# Altium schematic sheet MCU.SchDoc: FlightControlBoard-MCU
size A4; SheetNumber: 1; SheetTotal: 5
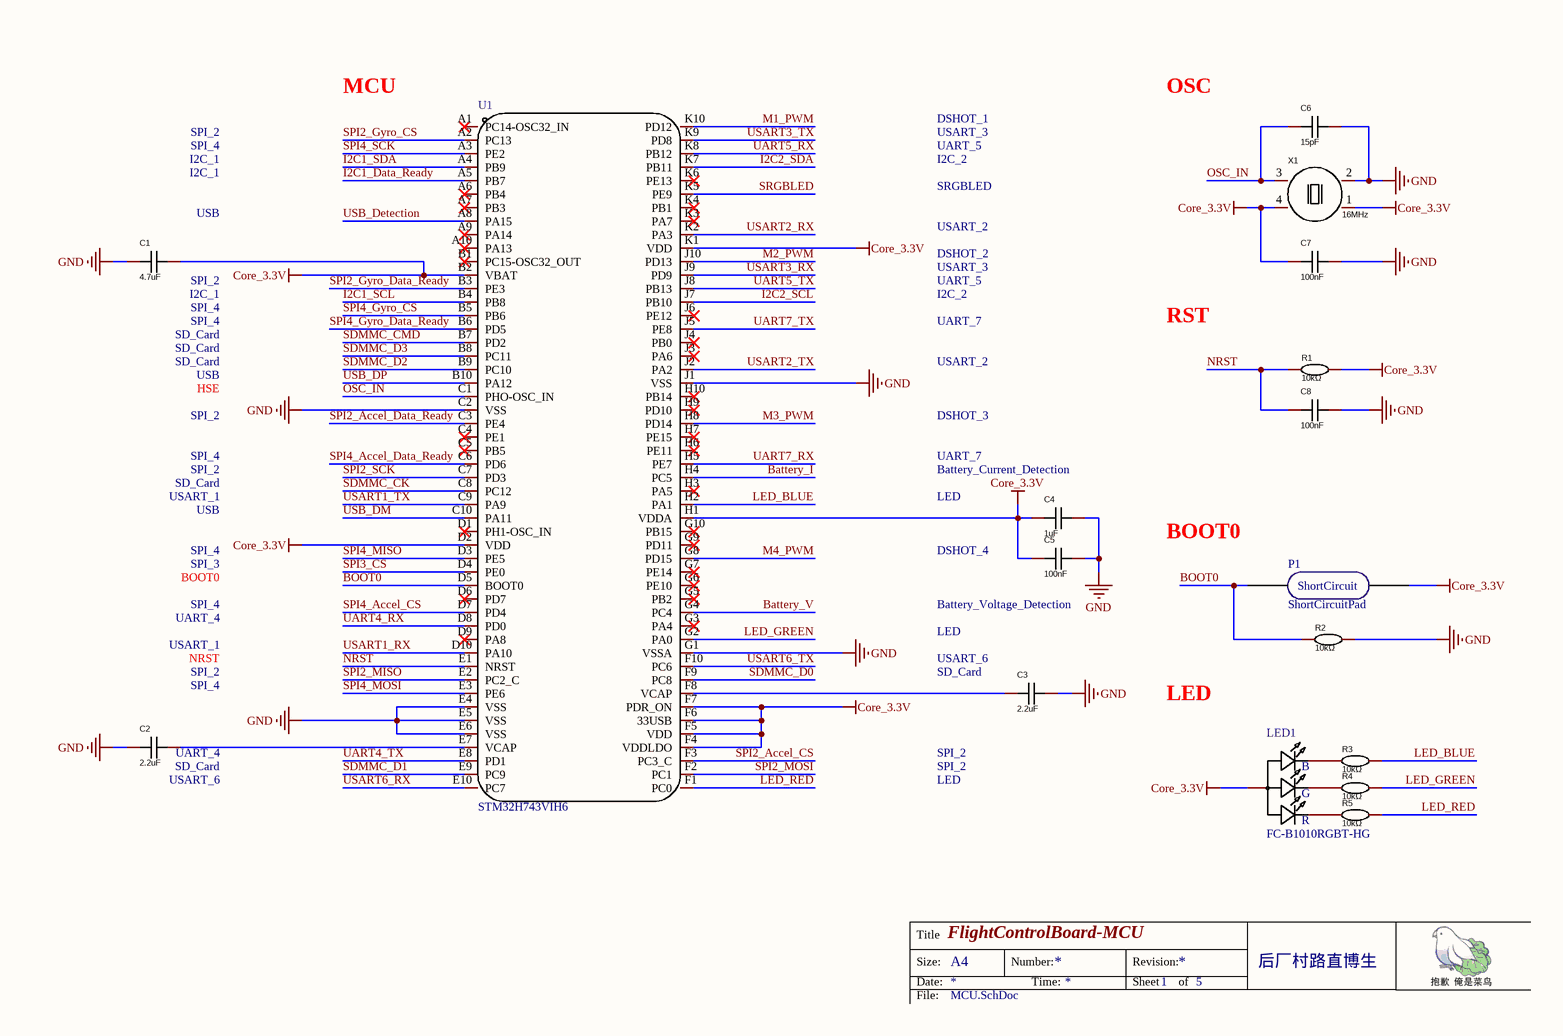
[diagram p0: MCU.SchDoc]

## Parts
C1  4.7uF  [C0402]
C2  2.2uF  [C0402]
C3  2.2uF  [C0402]
C4  1uF  [C0201]
C5  100nF  [C0201]
C6  15pF  [C0201]
C7  100nF  [C0201]
C8  100nF  [C0201]
LED1  FC-B1010RGBT-HG  [LED-ARRAY-SMD_4P-L1.0-W1.0-TR-RD]
P1  ShortCircuitPad  [ShortCircuitPad]
R1  10kΩ  [R0201]
R2  10kΩ  [R0201]
R3  10kΩ  [R0201]
R4  10kΩ  [R0201]
R5  10kΩ  [R0201]
U1  STM32H743VIH6  [BGA-100_L8.0-W8.0-P0.80-R10-C10-BL]
X1  value 16MHz  [OSC-SMD_4P-L2.5-W2.0-BL]  (hidden comment: X1G004171002700)

## Nets
Core_3.3V: C1.1 C4.2 C5.2 C7.2 LED1.1(+) P1.2 R1.2 U1.B2(VBAT) U1.D2(VDD) U1.F4(VDDLDO) U1.F5(VDD) U1.F6(33USB) U1.F7(PDR_ON) U1.H1(VDDA) U1.K1(VDD) X1.1(/ST) X1.4(VDD)
GND: C1.2 C2.2 C3.1 C4.1 C5.1 C6.1 C7.1 C8.1 R2.2 U1.C2(VSS) U1.E4(VSS) U1.E5(VSS) U1.E6(VSS) U1.G1(VSSA) U1.J1(VSS) X1.2(GND)
Battery_I: U1.H4(PC5)
Battery_V: U1.G4(PC4)
BOOT0: P1.1 R2.1 U1.D5(BOOT0)
I2C1_Data_Ready: U1.A5(PB7)
I2C1_SCL: U1.B4(PB8)
I2C1_SDA: U1.A4(PB9)
I2C2_SCL: U1.J7(PB10)
I2C2_SDA: U1.K7(PB11)
LED_BLUE: R3.2 U1.H2(PA1)
LED_GREEN: R4.2 U1.G2(PA0)
LED_RED: R5.2 U1.F1(PC0)
M1_PWM: U1.K10(PD12)
M2_PWM: U1.J10(PD13)
M3_PWM: U1.H8(PD14)
M4_PWM: U1.G8(PD15)
NRST: C8.2 R1.1 U1.E1(NRST)
OSC_IN: C6.2 U1.C1(PHO-OSC_IN) X1.3(OUT)
SDMMC_CK: U1.C8(PC12)
SDMMC_CMD: U1.B7(PD2)
SDMMC_D0: U1.F9(PC8)
SDMMC_D1: U1.E9(PC9)
SDMMC_D2: U1.B9(PC10)
SDMMC_D3: U1.B8(PC11)
SPI2_Accel_CS: U1.F3(PC3_C)
SPI2_Accel_Data_Ready: U1.C3(PE4)
SPI2_Gyro_CS: U1.A2(PC13)
SPI2_Gyro_Data_Ready: U1.B3(PE3)
SPI2_MISO: U1.E2(PC2_C)
SPI2_MOSI: U1.F2(PC1)
SPI2_SCK: U1.C7(PD3)
SPI3_CS: U1.D4(PE0)
SPI4_Accel_CS: U1.D7(PD4)
SPI4_Accel_Data_Ready: U1.C6(PD6)
SPI4_Gyro_CS: U1.B5(PB6)
SPI4_Gyro_Data_Ready: U1.B6(PD5)
SPI4_MISO: U1.D3(PE5)
SPI4_MOSI: U1.E3(PE6)
SPI4_SCK: U1.A3(PE2)
SRGBLED: U1.K5(PE9)
UART4_RX: U1.D8(PD0)
UART4_TX: U1.E8(PD1)
UART5_RX: U1.K8(PB12)
UART5_TX: U1.J8(PB13)
UART7_RX: U1.H5(PE7)
UART7_TX: U1.J5(PE8)
USART1_RX: U1.D10(PA10)
USART1_TX: U1.C9(PA9)
USART2_RX: U1.K2(PA3)
USART2_TX: U1.J2(PA2)
USART3_RX: U1.J9(PD9)
USART3_TX: U1.K9(PD8)
USART6_RX: U1.E10(PC7)
USART6_TX: U1.F10(PC6)
USB_Detection: U1.A8(PA15)
USB_DM: U1.C10(PA11)
USB_DP: U1.B10(PA12)
NetC2_1: C2.1 U1.E7(VCAP)
NetC3_2: C3.2 U1.F8(VCAP)
NetLED1_2: LED1.2(-) R5.1
NetLED1_3: LED1.3(-) R4.1
NetLED1_4: LED1.4(-) R3.1

Not connected (* = marked no-connect by the designer): U1 A1(PC14-OSC32_IN)* A6(PB4)* A7(PB3)* A9(PA14)* A10(PA13)* B1(PC15-OSC32_OUT)* C4(PE1)* C5(PB5)* D1(PH1-OSC_IN)* D6(PD7)* D9(PA8)* G3(PA4)* G5(PB2)* G6(PE10)* G7(PE14)* G9(PD11)* G10(PB15)* H3(PA5)* H6(PE11)* H7(PE15)* H9(PD10)* H10(PB14)* J3(PA6)* J4(PB0)* J6(PE12)* K3(PA7)* K4(PB1)* K6(PE13)*

## Notes on the sheet
- MCU
- OSC
- I2C_1
- SPI_2
- SPI_4
- I2C_2
- UART_5
- USART_3
- DSHOT_1
- USB
- USART_2
- SRGBLED
- (near C1) SPI_2
- (near C1) SPI_4
- (near C1) I2C_1
- DSHOT_2
- SD_Card
- UART_7
- RST
- HSE
- DSHOT_3
- USART_1
- (near C4) Battery_Current_Detection
- LED
- SPI_3
- BOOT0
- DSHOT_4
- UART_4
- (near C5) Battery_Voltage_Detection
- NRST
- (near C3) SD_Card
- (near C3) USART_6
- (near C2) SD_Card
- (near C2) UART_4
- (near C2) USART_6
- Title
- Size:
- Date:
- A4
- Number:
- Time:
- Revision:
- Sheet
- of
- 后厂村路直博生
- File:
- (in symbol FC-B1010RGBT-HG) B; G; R
- (in symbol ShortCircuitPad) ShortCircuit

## Library data of the parts
C1-C8 = CC0603KRX7R9BB104: Add into BOM: yes; Convert to PCB: yes
  C1: Value: 4.7uF
  C2 C3: Value: 2.2uF
  C4: Value: 1uF
  C5 C7 C8: Value: 100nF
  C6: Value: 15pF
LED1 = FC-B1010RGBT-HG: Manufacturer: 国星光电; Add into BOM: yes; Emitted Color: RGB三色; Name: FC-B1010RGBT-HG; Symbol: FC-B1010RGBT-HG; Device: FC-B1010RGBT-HG; LCSC Part Name: RGB三色 1010RGB   金线; Supplier Part: C158099; Manufacturer Part: FC-B1010RGBT-HG; Supplier Footprint: 0404; JLCPCB Part Class: Extended Part; Datasheet: https://atta.szlcsc.com/upload/public/pdf/source/20200910/C158099_0C805F16310A4C6DB0163E8F613FF382.pdf; Supplier: LCSC; Convert to PCB: yes
R1-R5 = 0603WAF1002T5E: Add into BOM: yes; Name: 10kΩ; Convert to PCB: yes; Value: 10kΩ
U1 = STM32H743VIH6: Manufacturer: ST(意法半导体); Add into BOM: yes; Name: STM32H743VIH6; Symbol: STM32H743VIH6; Device: STM32H743VIH6; LCSC Part Name: STM32H743VIH6; Supplier Part: C964146; Manufacturer Part: STM32H743VIH6; Supplier Footprint: TFBGA-100; JLCPCB Part Class: Extended Part; Datasheet: https://atta.szlcsc.com/upload/public/pdf/source/20220307/46489B78091107FB73FE6602EFA9948C.pdf; Supplier: LCSC; Convert to PCB: yes
X1 = X1G004171002700: Manufacturer: EPSON(爱普生); Add into BOM: yes; Supply Voltage: 1.6V~3.6V; Name: 16MHz; Symbol: X1G004171002700; Device: X1G004171002700; LCSC Part Name: 16MHz 1.6V~3.6V; Supplier Part: C255993; Manufacturer Part: X1G004171002700; Supplier Footprint: SMD2520-4P; JLCPCB Part Class: Extended Part; Datasheet: https://atta.szlcsc.com/upload/public/pdf/source/20180822/C255993_0296D9A145EF52AA9737C084400D904D.pdf; Supplier: LCSC; Convert to PCB: yes; Operating Temperature: -40℃~+85℃